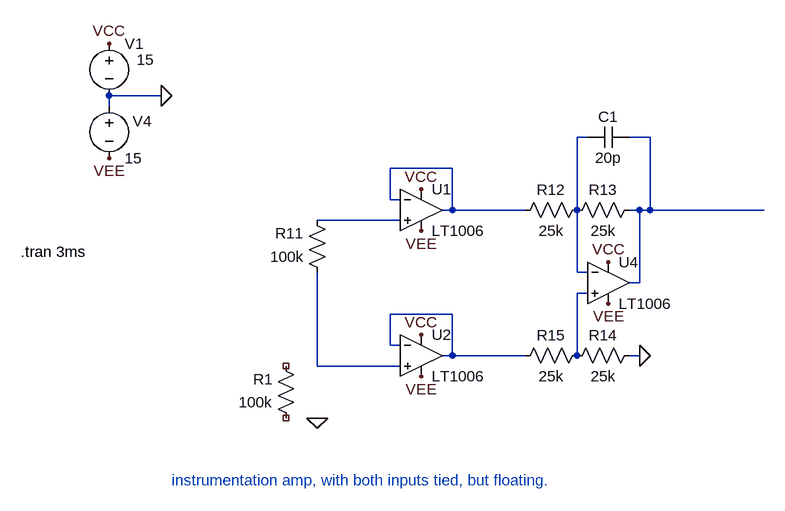
[diagram p0: schematic Draft01.asc]
Draft01.asc, the LTspice schematic file:
Version 4
SHEET 1 2756 2104
WIRE -288 -576 -368 -576
WIRE -368 -560 -368 -576
WIRE 368 -512 352 -512
WIRE 464 -512 432 -512
WIRE 160 -464 64 -464
WIRE 64 -416 64 -464
WIRE 80 -416 64 -416
WIRE 160 -400 160 -464
WIRE 160 -400 144 -400
WIRE 272 -400 160 -400
WIRE 352 -400 352 -512
WIRE 448 -400 432 -400
WIRE 464 -400 464 -512
WIRE 464 -400 448 -400
WIRE 640 -400 464 -400
WIRE 80 -384 -48 -384
WIRE 352 -304 352 -400
WIRE 368 -304 352 -304
WIRE 448 -288 448 -400
WIRE 448 -288 432 -288
WIRE 368 -272 352 -272
WIRE 160 -240 64 -240
WIRE 64 -192 64 -240
WIRE 80 -192 64 -192
WIRE 160 -176 160 -240
WIRE 160 -176 144 -176
WIRE 272 -176 160 -176
WIRE 352 -176 352 -272
WIRE 448 -176 432 -176
WIRE -48 -160 -48 -304
WIRE 80 -160 -48 -160
FLAG -368 -656 VCC
FLAG -368 -480 VEE
FLAG 112 -432 VCC
FLAG 112 -368 VEE
FLAG 400 -320 VCC
FLAG 400 -256 VEE
FLAG 112 -208 VCC
FLAG 112 -144 VEE
FLAG 448 -176 0
FLAG -48 -80 0
FLAG -288 -576 0
SYMBOL voltage -368 -672 R0
WINDOW 123 0 0 Left 0
WINDOW 39 0 0 Left 0
WINDOW 3 42 41 Left 2
SYMATTR Value 15
SYMATTR InstName V1
SYMBOL voltage -368 -576 R0
WINDOW 123 0 0 Left 0
WINDOW 39 0 0 Left 0
WINDOW 0 36 39 Left 2
SYMATTR InstName V4
SYMATTR Value 15
SYMBOL res -32 -288 R180
WINDOW 0 36 76 Left 2
WINDOW 3 36 40 Left 2
SYMATTR InstName R11
SYMATTR Value 100k
SYMBOL res 368 -416 R90
WINDOW 0 0 56 VBottom 2
WINDOW 3 32 56 VTop 2
SYMATTR InstName R12
SYMATTR Value 25k
SYMBOL res 448 -416 R90
WINDOW 0 0 56 VBottom 2
WINDOW 3 32 56 VTop 2
SYMATTR InstName R13
SYMATTR Value 25k
SYMBOL res 448 -192 R90
WINDOW 0 0 56 VBottom 2
WINDOW 3 32 56 VTop 2
SYMATTR InstName R14
SYMATTR Value 25k
SYMBOL res 368 -192 R90
WINDOW 0 0 56 VBottom 2
WINDOW 3 32 56 VTop 2
SYMATTR InstName R15
SYMATTR Value 25k
SYMBOL OpAmps\\LT1006 112 -464 R0
SYMATTR InstName U1
SYMBOL OpAmps\\LT1006 112 -240 R0
SYMATTR InstName U2
SYMBOL OpAmps\\LT1006 400 -352 R0
SYMATTR InstName U4
SYMBOL cap 432 -528 R90
WINDOW 0 0 32 VBottom 2
WINDOW 3 32 32 VTop 2
SYMATTR InstName C1
SYMATTR Value 20p
SYMBOL res -80 -64 R180
WINDOW 0 36 76 Left 2
WINDOW 3 36 40 Left 2
SYMATTR InstName R1
SYMATTR Value 100k
TEXT -504 -336 Left 2 !.tran 3ms
TEXT -272 16 Left 2 ;instrumentation amp, with both inputs tied, but floating.

The netlist it stands for:
* Draft01.asc
V1 VCC 0 15
V4 0 VEE 15
R11 N007 N004 100k
R12 N001 N003 25k
R13 N002 N001 25k
R14 0 N005 25k
R15 N005 N006 25k
XU1 N004 N003 VCC VEE N003 LT1006  ; pins In+ In- V+ V- OUT
XU2 N007 N006 VCC VEE N006 LT1006  ; pins In+ In- V+ V- OUT
XU4 N005 N001 VCC VEE N002 LT1006  ; pins In+ In- V+ V- OUT
C1 N002 N001 20p
R1 NC_01 NC_02 100k
.tran 3ms
* instrumentation amp, with both inputs tied, but floating.
.lib LTC.lib
.backanno
.end